# Altium project Davinci Resolve Editor Keyboard.PrjPcb
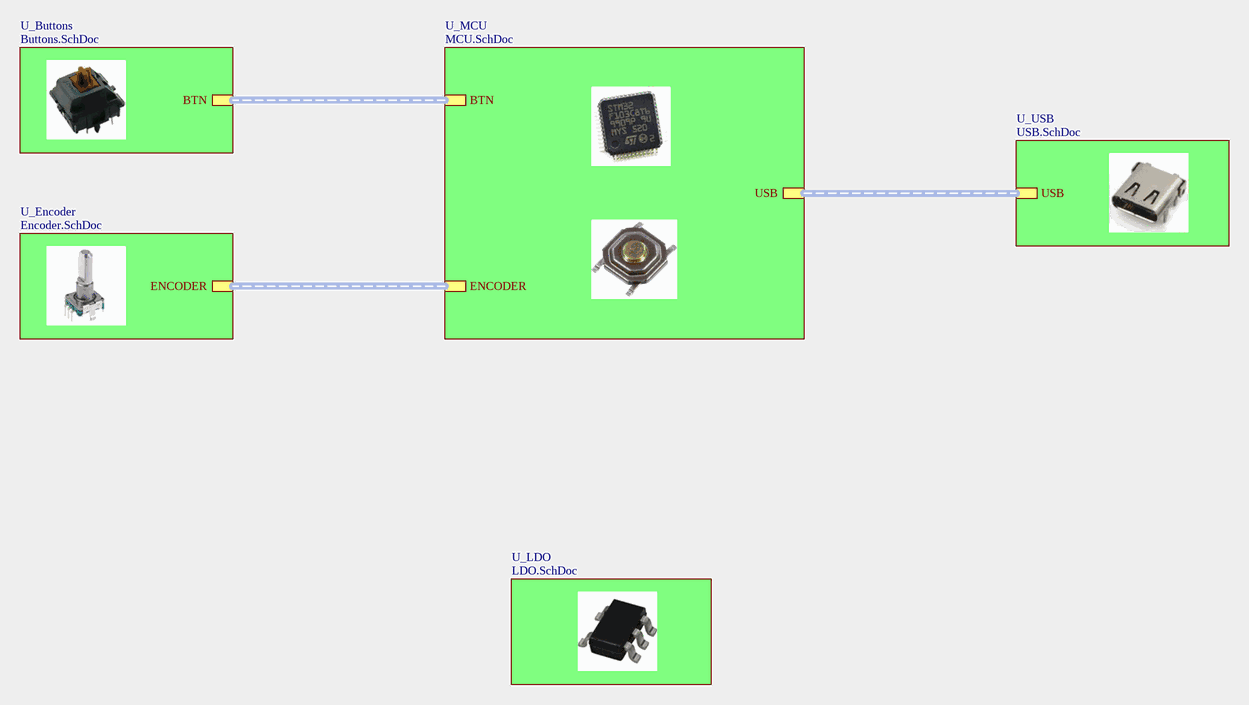
[diagram p0: Davinci Resolve Editor Keyboard.SchDoc]
6 sheets, 196 parts. Net scope: hierarchical (ports join the sheet entries above them; power ports are global).
Board file: Davinci Resolve Editor Keyboard 4.PcbDoc
Sheets:
  Davinci Resolve Editor Keyboard.SchDoc
    U_MCU = MCU.SchDoc
    U_Encoder = Encoder.SchDoc
    U_LDO = LDO.SchDoc
    U_Buttons = Buttons.SchDoc
    U_USB = USB.SchDoc

## Sheet Davinci Resolve Editor Keyboard.SchDoc: STM32F103 Mini Editor Keyboard
size A3; DrawnBy: Roman Sklyar; Organization: S-LAB; Address1: Russian Federation; Address2: Sergiev Posad; DocumentNumber: 1; Revision: v1.0; SheetNumber: 1; SheetTotal: 6

### Sub-sheets
U_Buttons = Buttons.SchDoc: BTN (harness BTN)
U_Encoder = Encoder.SchDoc: ENCODER (harness ENCODER)
U_LDO = LDO.SchDoc: no entries
U_MCU = MCU.SchDoc: BTN (harness BTN), ENCODER (harness ENCODER), USB (harness USB)
U_USB = USB.SchDoc: USB (harness USB)

### Buses and harness runs
harness sheet U_Buttons/BTN = sheet U_MCU/BTN
harness sheet U_Encoder/ENCODER = sheet U_MCU/ENCODER
harness sheet U_MCU/USB = sheet U_USB/USB

### Notes on the sheet
- Title
- Size:
- Date:
- A3
- Number:
- Time:
- Revision:
- Sheet
- of
- File:

## Sheet MCU.SchDoc: Mini Editor Keyboard
size A3; DrawnBy: Roman Sklyar; Organization: S-LAB; Address1: Russian Federation; Address2: Sergiev Posad; DocumentNumber: 2; Revision: v1.0; SheetNumber: 2; SheetTotal: 6
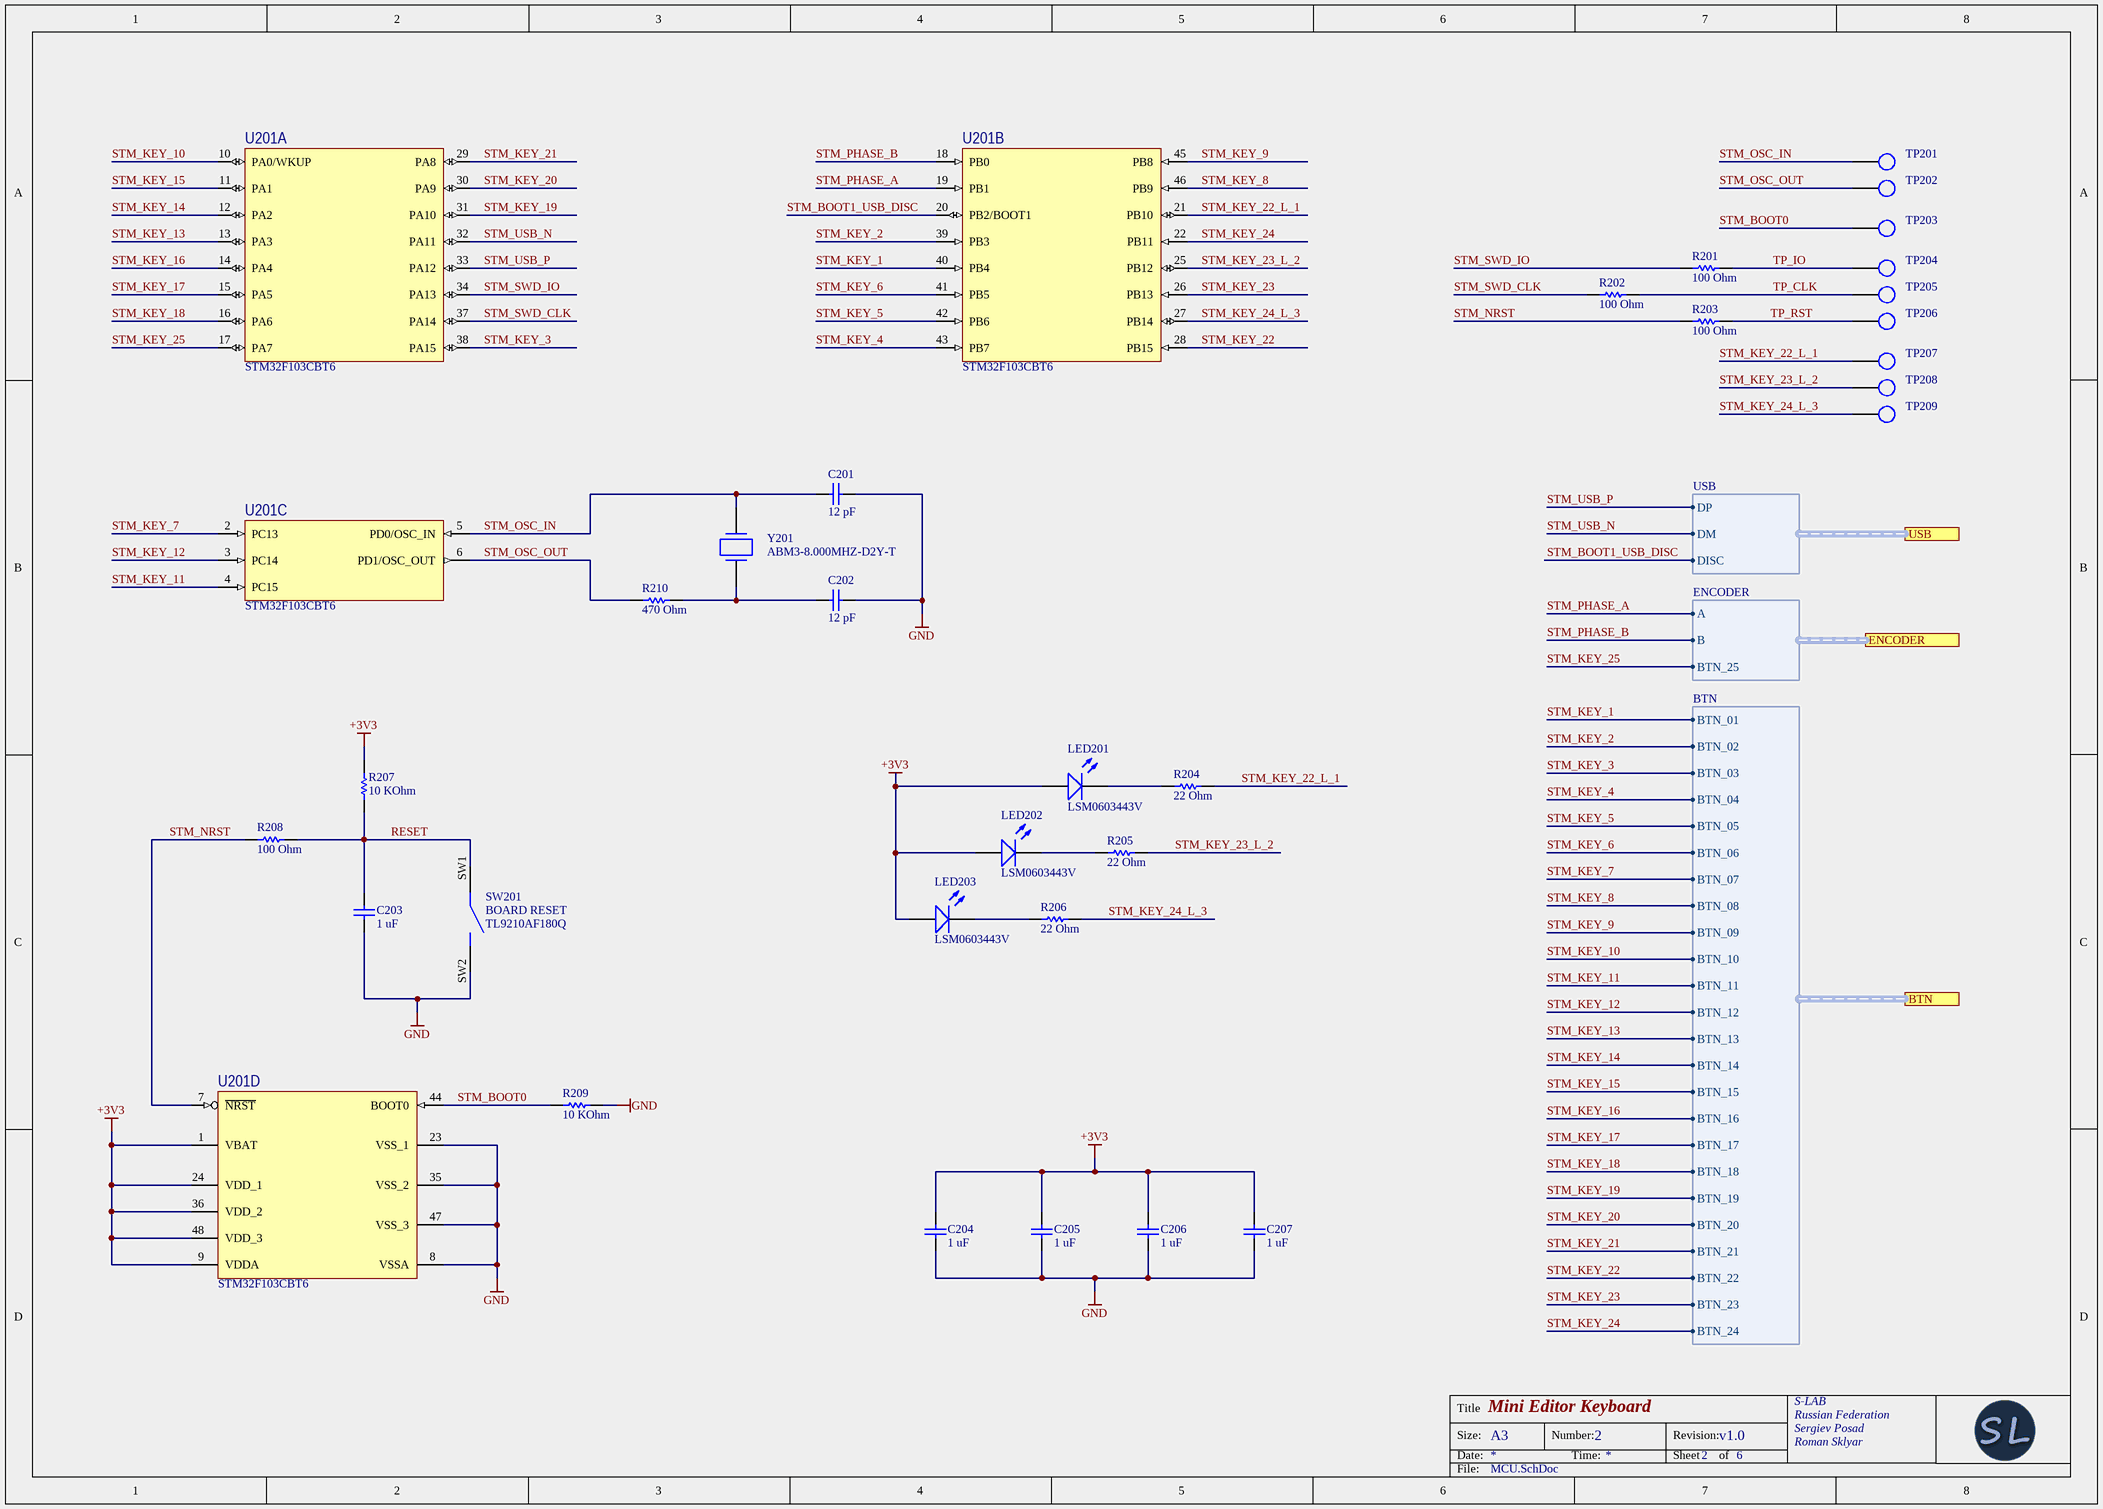
[diagram p1: MCU.SchDoc]

### Parts
C201  Capacitance: 12 pF  [CAPC0603]  (hidden comment: CAP-12P)
C202  Capacitance: 12 pF  [CAPC0603]  (hidden comment: CAP-12P)
C203  Capacitance: 1 uF  [CAPC0805]  (hidden comment: CAP-1U)
C204  Capacitance: 1 uF  [CAPC0805]  (hidden comment: CAP-1U)
C205  Capacitance: 1 uF  [CAPC0805]  (hidden comment: CAP-1U)
C206  Capacitance: 1 uF  [CAPC0805]  (hidden comment: CAP-1U)
C207  Capacitance: 1 uF  [CAPC0805]  (hidden comment: CAP-1U)
LED201  LSM0603443V  [LSM0603-Series]
LED202  LSM0603443V  [LSM0603-Series]
LED203  LSM0603443V  [LSM0603-Series]
R201  Resistance: 100 Ohm  [RES0603]  (hidden comment: RES-100)
R202  Resistance: 100 Ohm  [RES0603]  (hidden comment: RES-100)
R203  Resistance: 100 Ohm  [RES0603]  (hidden comment: RES-100)
R204  Resistance: 22 Ohm  [RES0603]  (hidden comment: RES-22)
R205  Resistance: 22 Ohm  [RES0603]  (hidden comment: RES-22)
R206  Resistance: 22 Ohm  [RES0603]  (hidden comment: RES-22)
R207  Resistance: 10 KOhm  [RES0603]  (hidden comment: RES-10K)
R208  Resistance: 100 Ohm  [RES0603]  (hidden comment: RES-100)
R209  Resistance: 10 KOhm  [RES0603]  (hidden comment: RES-10K)
R210  Resistance: 470 Ohm  [RES0603]  (hidden comment: RES-470)
SW201  BOARD RESET  [TL9210AF180Q]
TP201  (no value)  [TP_C-0.5mm]  (no BOM)
TP202  (no value)  [TP_C-0.5mm]  (no BOM)
TP203  (no value)  [TP_C-0.5mm]  (no BOM)
TP204  (no value)  [TP_C-0.5mm]  (no BOM)
TP205  (no value)  [TP_C-0.5mm]  (no BOM)
TP206  (no value)  [TP_C-0.5mm]  (no BOM)
TP207  (no value)  [TP_C-0.5mm]  (no BOM)
TP208  (no value)  [TP_C-0.5mm]  (no BOM)
TP209  (no value)  [TP_C-0.5mm]  (no BOM)
U201  STM32F103CBT6  [LQFP-48-STM32]  (parts A,B,C,D of 4)
Y201  ABM3-8.000MHZ-D2Y-T  [ABM3-2P]

### Ports
BTN (harness BTN), ENCODER (harness ENCODER), USB (harness USB)

### Harnesses
BTN: BTN_10, BTN_11, BTN_09, BTN_12, BTN_13, BTN_14, BTN_15, BTN_16, BTN_17, BTN_18, BTN_19, BTN_08, BTN_07, BTN_06, BTN_05, BTN_04, BTN_03, BTN_02, BTN_01, BTN_20, BTN_21, BTN_22, BTN_23, BTN_24
USB: DP, DM, DISC
ENCODER: A, B, BTN_25

### Nets
+3V3: C204.2 C205.2 C206.2 C207.2 LED201.2(A) LED202.2(A) LED203.2(A) R207.2 U201.1(VBAT) U201.9(VDDA) U201.24(VDD_1) U201.36(VDD_2) U201.48(VDD_3)
GND: C201.1 C202.1 C203.2 C204.1 C205.1 C206.1 C207.1 R209.2 SW201.SW2 U201.8(VSSA) U201.23(VSS_1) U201.35(VSS_2) U201.47(VSS_3)
RESET: C203.1 R207.1 R208.2 SW201.SW1  [project net RESET_2]
STM_BOOT0: R209.1 TP203.1 U201.44(BOOT0)  [project net STM_BOOT0_2]
STM_BOOT1_USB_DISC: U201.20(PB2/BOOT1) ; port USB.DISC
STM_KEY_1: U201.40(PB4) ; port BTN.BTN_01
STM_KEY_2: U201.39(PB3) ; port BTN.BTN_02
STM_KEY_3: U201.38(PA15) ; port BTN.BTN_03
STM_KEY_4: U201.43(PB7) ; port BTN.BTN_04
STM_KEY_5: U201.42(PB6) ; port BTN.BTN_05
STM_KEY_6: U201.41(PB5) ; port BTN.BTN_06
STM_KEY_7: U201.2(PC13) ; port BTN.BTN_07
STM_KEY_8: U201.46(PB9) ; port BTN.BTN_08
STM_KEY_9: U201.45(PB8) ; port BTN.BTN_09
STM_KEY_10: U201.10(PA0/WKUP) ; port BTN.BTN_10
STM_KEY_11: U201.4(PC15) ; port BTN.BTN_11
STM_KEY_12: U201.3(PC14) ; port BTN.BTN_12
STM_KEY_13: U201.13(PA3) ; port BTN.BTN_13
STM_KEY_14: U201.12(PA2) ; port BTN.BTN_14
STM_KEY_15: U201.11(PA1) ; port BTN.BTN_15
STM_KEY_16: U201.14(PA4) ; port BTN.BTN_16
STM_KEY_17: U201.15(PA5) ; port BTN.BTN_17
STM_KEY_18: U201.16(PA6) ; port BTN.BTN_18
STM_KEY_19: U201.31(PA10) ; port BTN.BTN_19
STM_KEY_20: U201.30(PA9) ; port BTN.BTN_20
STM_KEY_21: U201.29(PA8) ; port BTN.BTN_21
STM_KEY_22: U201.28(PB15) ; port BTN.BTN_22
STM_KEY_22_L_1: R204.2 TP207.1 U201.21(PB10)  [project net STM_KEY_22_L_1_2]
STM_KEY_23: U201.26(PB13) ; port BTN.BTN_23
STM_KEY_23_L_2: R205.2 TP208.1 U201.25(PB12)  [project net STM_KEY_23_L_2_2]
STM_KEY_24: U201.22(PB11) ; port BTN.BTN_24
STM_KEY_24_L_3: R206.2 TP209.1 U201.27(PB14)  [project net STM_KEY_24_L_3_2]
STM_KEY_25: U201.17(PA7) ; port ENCODER.BTN_25
STM_NRST: R203.1 R208.1 U201.7(~{NRST})  [project net STM_NRST_2]
STM_OSC_IN: C201.2 TP201.1 U201.5(PD0/OSC_IN) Y201.2(OSC2)  [project net STM_OSC_IN_2]
STM_OSC_OUT: R210.1 TP202.1 U201.6(PD1/OSC_OUT)  [project net STM_OSC_OUT_2]
STM_PHASE_A: U201.19(PB1) ; port ENCODER.A
STM_PHASE_B: U201.18(PB0) ; port ENCODER.B
STM_SWD_CLK: R202.1 U201.37(PA14)  [project net STM_SWD_CLK_2]
STM_SWD_IO: R201.1 U201.34(PA13)  [project net STM_SWD_IO_2]
STM_USB_N: U201.32(PA11) ; port USB.DM
STM_USB_P: U201.33(PA12) ; port USB.DP
TP_CLK: R202.2 TP205.1  [project net TP_CLK_2]
TP_IO: R201.2 TP204.1  [project net TP_IO_2]
TP_RST: R203.2 TP206.1  [project net TP_RST_2]
NetC202_2: C202.2 R210.2 Y201.1(OSC1)
NetLED201_1: LED201.1(K) R204.1
NetLED202_1: LED202.1(K) R205.1
NetLED203_1: LED203.1(K) R206.1

### Notes on the sheet
- Title
- Size:
- Date:
- A3
- Number:
- Time:
- Revision:
- Sheet
- of
- File:

### Library data of the parts
C201 C202 = CAP-12P: Chip Capacitor, 12 pF, +/- 5%; Voltage Rating: 50 V; Mount: Surface Mount; Tolerance: 5 %; Type: Capacitor
C203-C207 = CAP-1U: Chip Capacitor, 1 uF, +/- 5%; Voltage Rating: 50 V; Mount: Surface Mount; Tolerance: 5 %; Type: Capacitor
LED201-LED203 = LSM0603443V: White LED 0603 3V 20mA; Mount: Surface Mount; Type: LED; Color: White; PartNumber: LSM0603443V
R201-R203 R208 = RES-100: Chip Resistor, 100 Ohm, +/- 1%; Voltage Rating: 50 V; Mount: Surface Mount; Tolerance: 1 %; Type: Resistor
R204-R206 = RES-22: Chip Resistor, 22 Ohm, +/- 1%; Voltage Rating: 50 V; Mount: Surface Mount; Tolerance: 1 %; Type: Resistor
R207 R209 = RES-10K: Chip Resistor, 10 KOhm, +/- 1%; Voltage Rating: 50 V; Mount: Surface Mount; Tolerance: 1 %; Type: Resistor
R210 = RES-470: Chip Resistor, 470 Ohm, +/- 1%; Voltage Rating: 50 V; Mount: Surface Mount; Tolerance: 1 %; Type: Resistor
SW201 = TL9210AF180Q: SMD Tactile Switch, SPST, 180 gf, 12 VDC, 50 mA; Type: Tactile Switch Soft; Mount: Surface Mount; Model: TL9210AF180Q
TP201-TP209 = TestPad
U201 = STM32F103C8T6: ARM based 32-bit MCU with 64 or 128 KB Flash; Digit: 32 bit; Type: Microcontroller; Mount: Surface Mount; PartNumber: STM32F103CBT6
Y201 = ABM3-8.000MHZ-D2Y-T: 8MHz ±20ppm 18pF 140 Ohm SMD Crystal Resonators; Type: Quartz Crystal Resonator; Mount: Surface Mount; Frequency: 8 MHz; PartNumber: ABM3-8.000MHZ-D2Y-T

## Sheet Encoder.SchDoc: Mini Editor Keyboard
size A3; DrawnBy: Roman Sklyar; Organization: S-LAB; Address1: Russian Federation; Address2: Sergiev Posad; DocumentNumber: 5; Revision: v1.0; SheetNumber: 5; SheetTotal: 6
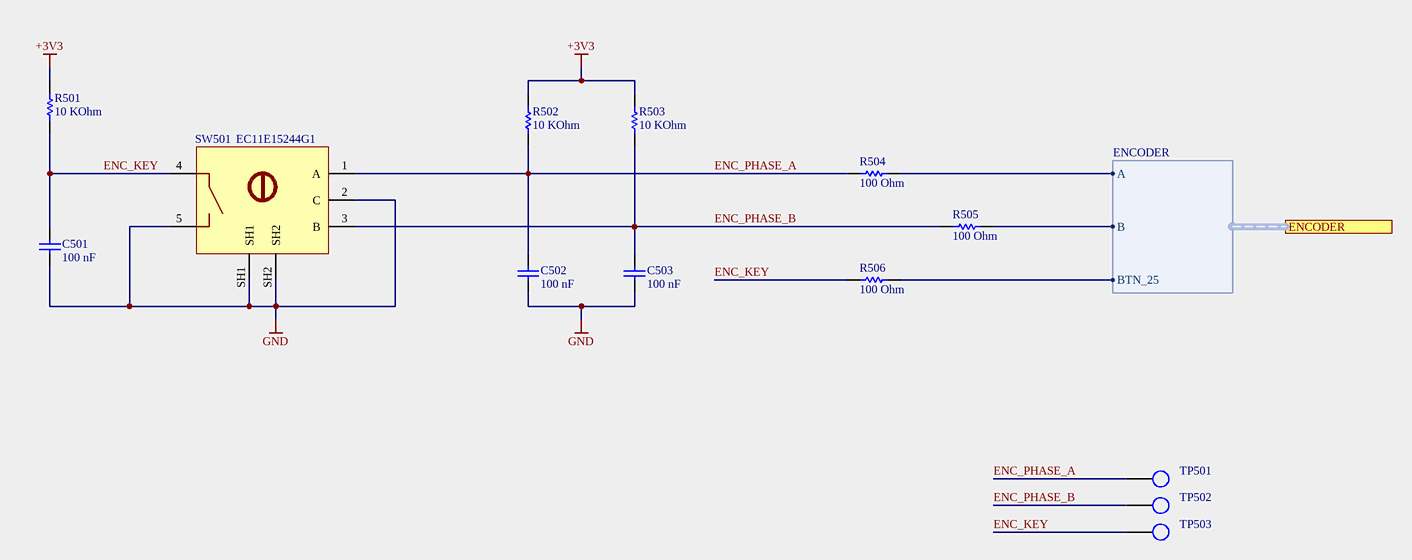
[diagram p2: Encoder.SchDoc]

### Parts
C501  Capacitance: 100 nF  [CAPC0603]  (hidden comment: CAP-100N)
C502  Capacitance: 100 nF  [CAPC0603]  (hidden comment: CAP-100N)
C503  Capacitance: 100 nF  [CAPC0603]  (hidden comment: CAP-100N)
R501  Resistance: 10 KOhm  [RES0603]  (hidden comment: RES-10K)
R502  Resistance: 10 KOhm  [RES0603]  (hidden comment: RES-10K)
R503  Resistance: 10 KOhm  [RES0603]  (hidden comment: RES-10K)
R504  Resistance: 100 Ohm  [RES0603]  (hidden comment: RES-100)
R505  Resistance: 100 Ohm  [RES0603]  (hidden comment: RES-100)
R506  Resistance: 100 Ohm  [RES0603]  (hidden comment: RES-100)
SW501  EC11E15244G1  [EC11E15244G1]
TP501  (no value)  [TP_C-0.5mm]  (no BOM)
TP502  (no value)  [TP_C-0.5mm]  (no BOM)
TP503  (no value)  [TP_C-0.5mm]  (no BOM)

### Ports
ENCODER (harness ENCODER)

### Harnesses
ENCODER: A, B, BTN_25

### Nets
+3V3: R501.2 R502.2 R503.2
GND: C501.1 C502.1 C503.1 SW501.2(C) SW501.5 SW501.SH1 SW501.SH2
ENC_KEY: C501.2 R501.1 R506.1 SW501.4 TP503.1  [project net ENC_KEY_5]
ENC_PHASE_A: C502.2 R502.1 R504.1 SW501.1(A) TP501.1  [project net ENC_PHASE_A_5]
ENC_PHASE_B: C503.2 R503.1 R505.1 SW501.3(B) TP502.1  [project net ENC_PHASE_B_5]
STM_KEY_25: R506.2 ; port ENCODER.BTN_25
STM_PHASE_A: R504.2 ; port ENCODER.A
STM_PHASE_B: R505.2 ; port ENCODER.B

### Notes on the sheet
- Title
- Size:
- Date:
- A3
- Number:
- Time:
- Revision:
- Sheet
- of
- File:

### Library data of the parts
C501-C503 = CAP-100N: Chip Capacitor, 100 nF, +/- 5%; Voltage Rating: 50 V; Mount: Surface Mount; Tolerance: 5 %; Type: Capacitor
R501-R503 = RES-10K: as R207 on sheet MCU; Mount: Surface Mount; Tolerance: 1 %; Type: Resistor
R504-R506 = RES-100: as R201 on sheet MCU; Mount: Surface Mount; Tolerance: 1 %; Type: Resistor
SW501 = EC11E15244G1: 11mm Size Metal Shaft Type Encoder; Manufacture: Alpsalpine; LengthShaft: 20 mm; NumberPulse: 15; Type: Encoder; Mount: True Hole; PartNumber: EC11E15244G1
TP501-TP503 = TestPad

## Sheet LDO.SchDoc: Mini Editor Keyboard
size A3; DrawnBy: Roman Sklyar; Organization: S-LAB; Address1: Russian Federation; Address2: Sergiev Posad; DocumentNumber: 3; Revision: v1.0; SheetNumber: 3; SheetTotal: 6
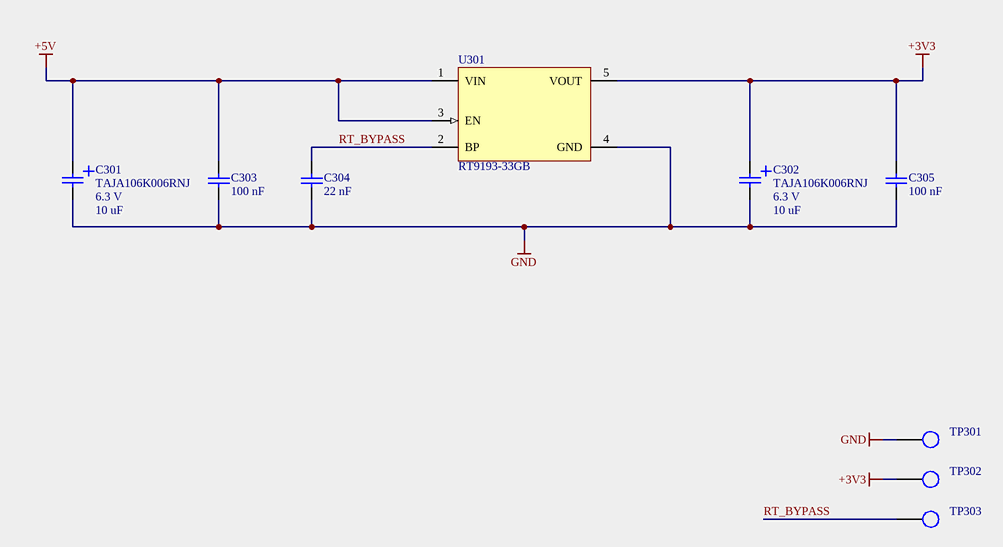
[diagram p3: LDO.SchDoc]

### Parts
C301  PartNumber: TAJA106K006RNJ  Voltage Rating: 6.3 V  Capacitance: 10 uF  [CAPMP-A-1206-3216X18]  (hidden comment: CAP-10U-6V3_A)
C302  PartNumber: TAJA106K006RNJ  Voltage Rating: 6.3 V  Capacitance: 10 uF  [CAPMP-A-1206-3216X18]  (hidden comment: CAP-10U-6V3_A)
C303  Capacitance: 100 nF  [CAPC0603]  (hidden comment: CAP-100N)
C304  Capacitance: 22 nF  [CAPC0603]  (hidden comment: CAP-22N)
C305  Capacitance: 100 nF  [CAPC0603]  (hidden comment: CAP-100N)
TP301  (no value)  [TP_C-0.5mm]  (no BOM)
TP302  (no value)  [TP_C-0.5mm]  (no BOM)
TP303  (no value)  [TP_C-0.5mm]  (no BOM)
U301  RT9193-33GB  [SOT-23-5-RICHTEK]

### Nets
+3V3: C302.1 C305.2 TP302.1 U301.5(VOUT)
+5V: C301.1 C303.2 U301.1(VIN) U301.3(EN)
GND: C301.2 C302.2 C303.1 C304.1 C305.1 TP301.1 U301.4(GND)
RT_BYPASS: C304.2 TP303.1 U301.2(BP)  [project net RT_BYPASS_3]

### Notes on the sheet
- Title
- Size:
- Date:
- A3
- Number:
- Time:
- Revision:
- Sheet
- of
- File:

### Library data of the parts
C301 C302 = CAP-10U-6V3_A: 10uF ±10% 6.3V -55℃ ~ +125℃ Tantalum Capacitors; Mount: Surface Mount; Type: Tantalum Capacitor
C303 C305 = CAP-100N: as C501 on sheet Encoder; Mount: Surface Mount; Tolerance: 5 %; Type: Capacitor
C304 = CAP-22N: Chip Capacitor, 22 nF, +/- 5%; Voltage Rating: 50 V; Mount: Surface Mount; Tolerance: 5 %; Type: Capacitor
TP301-TP303 = TestPad
U301 = RT9193-33GB: Fixed 5.5V 3.3V 220mV @ 300mA SOT-23-5 Dropout Regulators(LDO); Type: LDO; Mount: Surface Mount; Package: SOT-23-5; PartNumber: RT9193-33GB

## Sheet Buttons.SchDoc: Mini Editor Keyboard
size A2; DrawnBy: Roman Sklyar; Organization: S-LAB; Address1: Russian Federation; Address2: Sergiev Posad; DocumentNumber: 6; Revision: v1.0; SheetNumber: 6; SheetTotal: 6
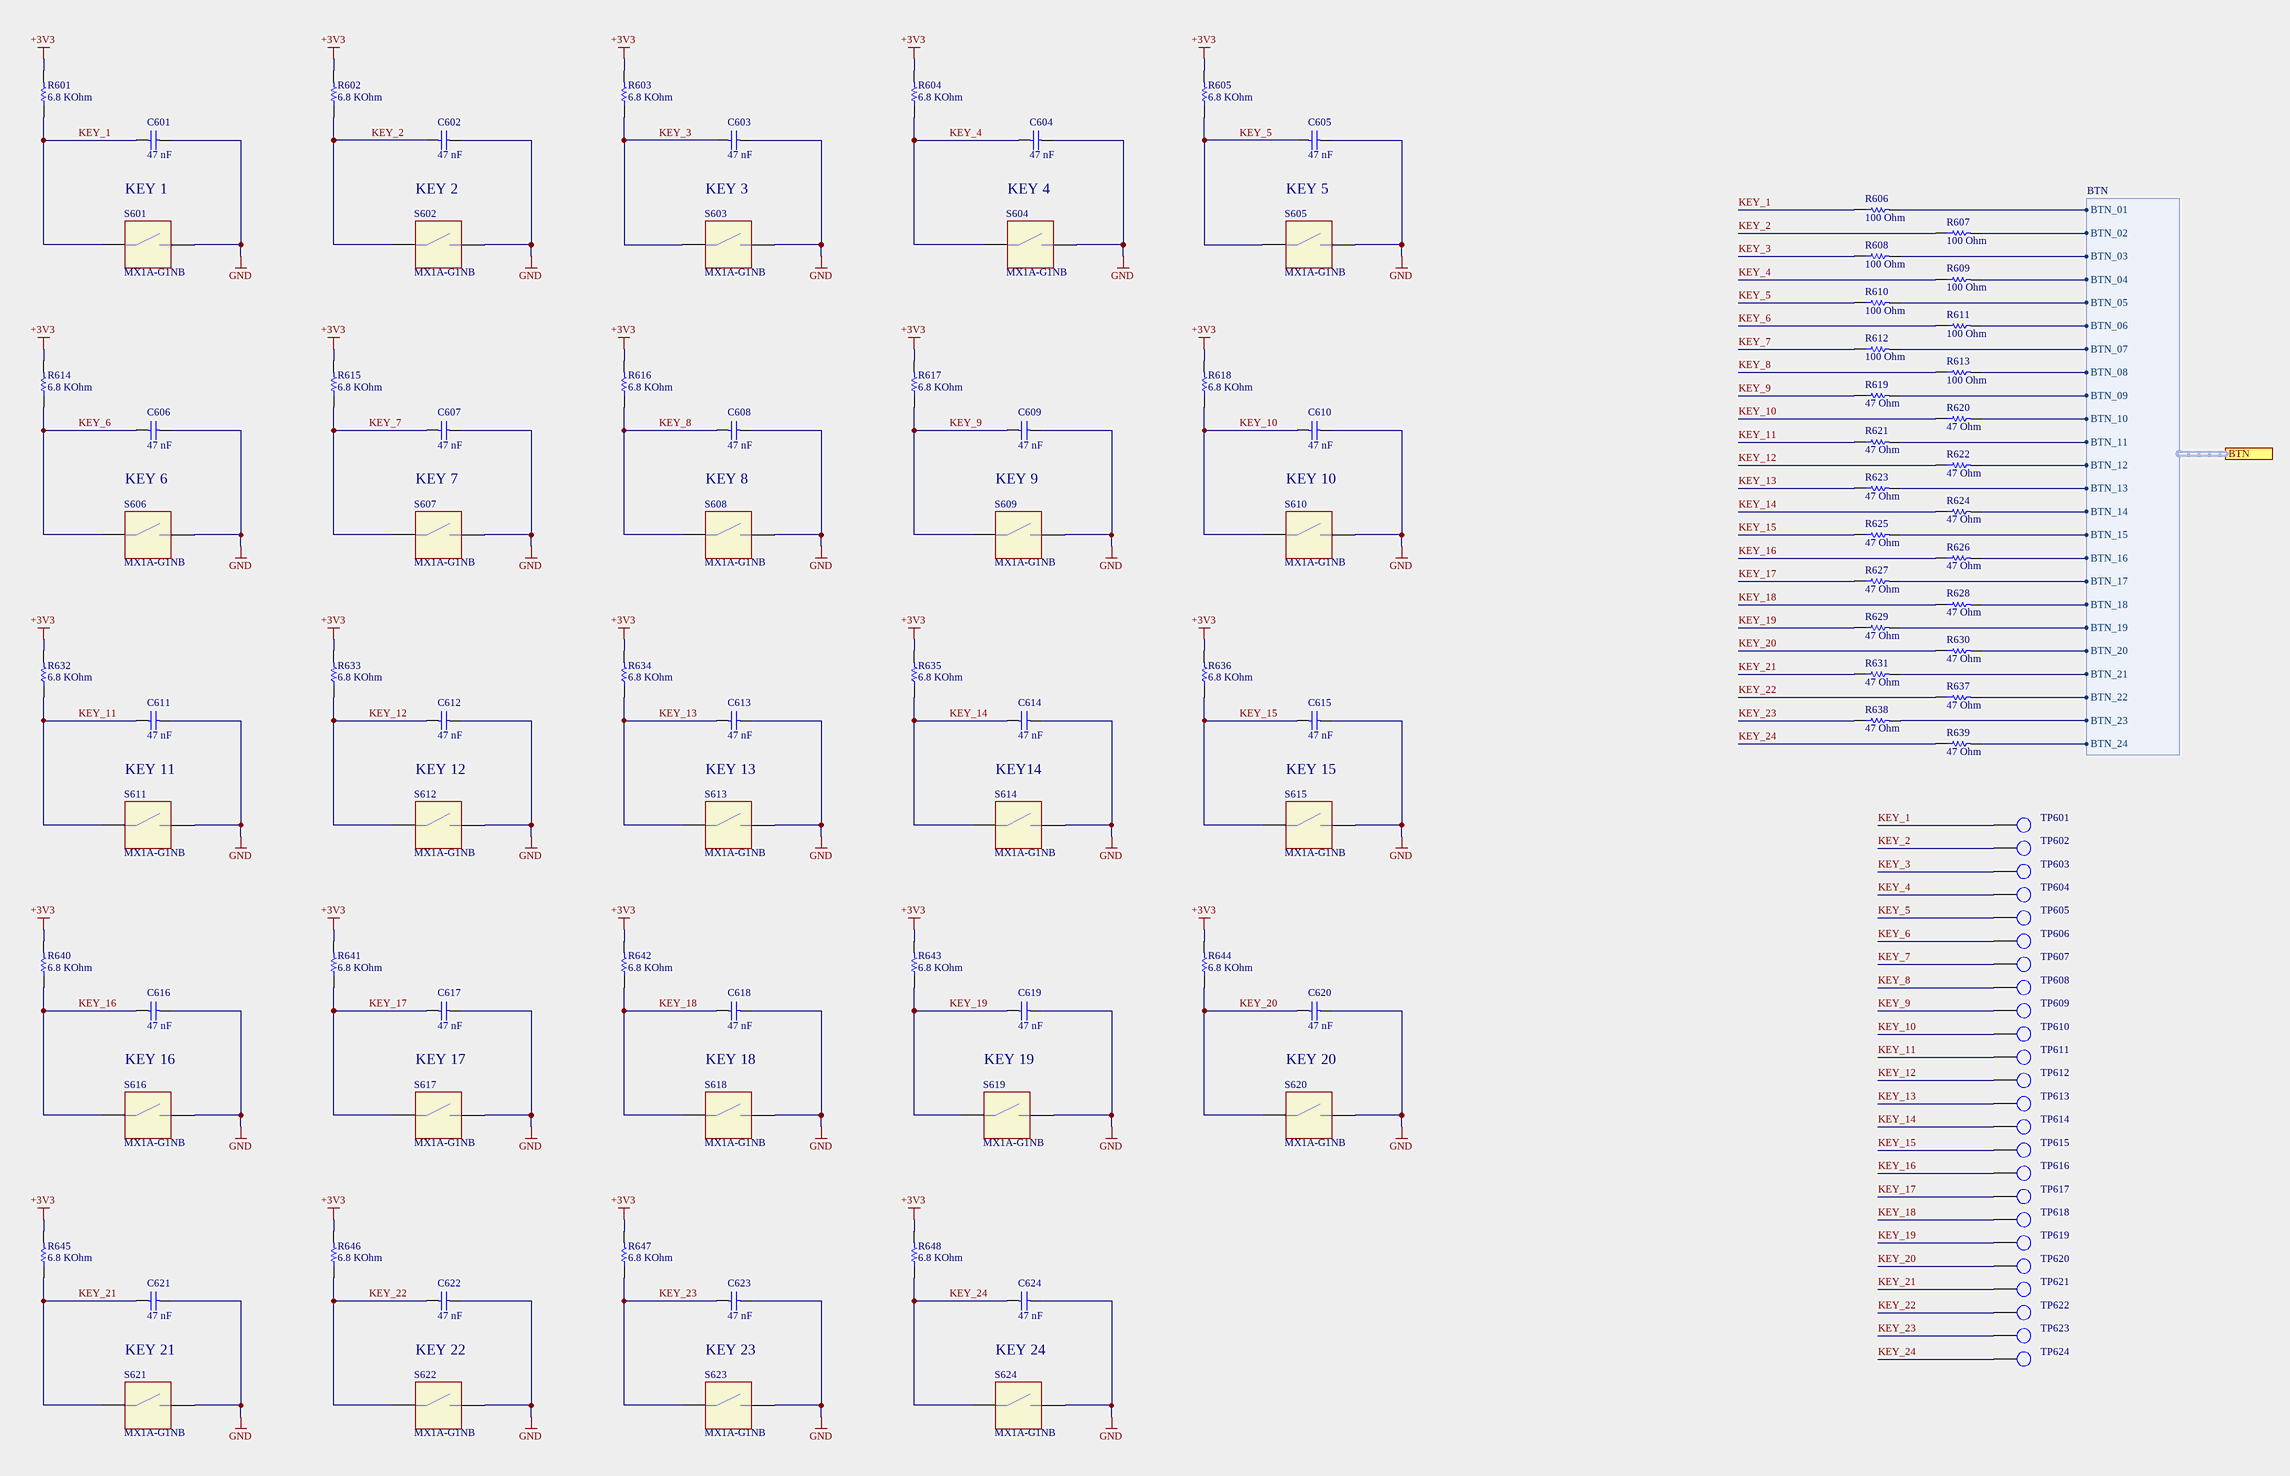
[diagram p4: Buttons.SchDoc]

### Parts
C601  Capacitance: 47 nF  [CAPC0603]  (hidden comment: CAP-47N)
C602  Capacitance: 47 nF  [CAPC0603]  (hidden comment: CAP-47N)
C603  Capacitance: 47 nF  [CAPC0603]  (hidden comment: CAP-47N)
C604  Capacitance: 47 nF  [CAPC0603]  (hidden comment: CAP-47N)
C605  Capacitance: 47 nF  [CAPC0603]  (hidden comment: CAP-47N)
C606  Capacitance: 47 nF  [CAPC0603]  (hidden comment: CAP-47N)
C607  Capacitance: 47 nF  [CAPC0603]  (hidden comment: CAP-47N)
C608  Capacitance: 47 nF  [CAPC0603]  (hidden comment: CAP-47N)
C609  Capacitance: 47 nF  [CAPC0603]  (hidden comment: CAP-47N)
C610  Capacitance: 47 nF  [CAPC0603]  (hidden comment: CAP-47N)
C611  Capacitance: 47 nF  [CAPC0603]  (hidden comment: CAP-47N)
C612  Capacitance: 47 nF  [CAPC0603]  (hidden comment: CAP-47N)
C613  Capacitance: 47 nF  [CAPC0603]  (hidden comment: CAP-47N)
C614  Capacitance: 47 nF  [CAPC0603]  (hidden comment: CAP-47N)
C615  Capacitance: 47 nF  [CAPC0603]  (hidden comment: CAP-47N)
C616  Capacitance: 47 nF  [CAPC0603]  (hidden comment: CAP-47N)
C617  Capacitance: 47 nF  [CAPC0603]  (hidden comment: CAP-47N)
C618  Capacitance: 47 nF  [CAPC0603]  (hidden comment: CAP-47N)
C619  Capacitance: 47 nF  [CAPC0603]  (hidden comment: CAP-47N)
C620  Capacitance: 47 nF  [CAPC0603]  (hidden comment: CAP-47N)
C621  Capacitance: 47 nF  [CAPC0603]  (hidden comment: CAP-47N)
C622  Capacitance: 47 nF  [CAPC0603]  (hidden comment: CAP-47N)
C623  Capacitance: 47 nF  [CAPC0603]  (hidden comment: CAP-47N)
C624  Capacitance: 47 nF  [CAPC0603]  (hidden comment: CAP-47N)
R601  Resistance: 6.8 KOhm  [RES0603]  (hidden comment: RES-6K8)
R602  Resistance: 6.8 KOhm  [RES0603]  (hidden comment: RES-6K8)
R603  Resistance: 6.8 KOhm  [RES0603]  (hidden comment: RES-6K8)
R604  Resistance: 6.8 KOhm  [RES0603]  (hidden comment: RES-6K8)
R605  Resistance: 6.8 KOhm  [RES0603]  (hidden comment: RES-6K8)
R606  Resistance: 100 Ohm  [RES0603]  (hidden comment: RES-100)
R607  Resistance: 100 Ohm  [RES0603]  (hidden comment: RES-100)
R608  Resistance: 100 Ohm  [RES0603]  (hidden comment: RES-100)
R609  Resistance: 100 Ohm  [RES0603]  (hidden comment: RES-100)
R610  Resistance: 100 Ohm  [RES0603]  (hidden comment: RES-100)
R611  Resistance: 100 Ohm  [RES0603]  (hidden comment: RES-100)
R612  Resistance: 100 Ohm  [RES0603]  (hidden comment: RES-100)
R613  Resistance: 100 Ohm  [RES0603]  (hidden comment: RES-100)
R614  Resistance: 6.8 KOhm  [RES0603]  (hidden comment: RES-6K8)
R615  Resistance: 6.8 KOhm  [RES0603]  (hidden comment: RES-6K8)
R616  Resistance: 6.8 KOhm  [RES0603]  (hidden comment: RES-6K8)
R617  Resistance: 6.8 KOhm  [RES0603]  (hidden comment: RES-6K8)
R618  Resistance: 6.8 KOhm  [RES0603]  (hidden comment: RES-6K8)
R619  Resistance: 47 Ohm  [RES0603]  (hidden comment: RES-47)
R620  Resistance: 47 Ohm  [RES0603]  (hidden comment: RES-47)
R621  Resistance: 47 Ohm  [RES0603]  (hidden comment: RES-47)
R622  Resistance: 47 Ohm  [RES0603]  (hidden comment: RES-47)
R623  Resistance: 47 Ohm  [RES0603]  (hidden comment: RES-47)
R624  Resistance: 47 Ohm  [RES0603]  (hidden comment: RES-47)
R625  Resistance: 47 Ohm  [RES0603]  (hidden comment: RES-47)
R626  Resistance: 47 Ohm  [RES0603]  (hidden comment: RES-47)
R627  Resistance: 47 Ohm  [RES0603]  (hidden comment: RES-47)
R628  Resistance: 47 Ohm  [RES0603]  (hidden comment: RES-47)
R629  Resistance: 47 Ohm  [RES0603]  (hidden comment: RES-47)
R630  Resistance: 47 Ohm  [RES0603]  (hidden comment: RES-47)
R631  Resistance: 47 Ohm  [RES0603]  (hidden comment: RES-47)
R632  Resistance: 6.8 KOhm  [RES0603]  (hidden comment: RES-6K8)
R633  Resistance: 6.8 KOhm  [RES0603]  (hidden comment: RES-6K8)
R634  Resistance: 6.8 KOhm  [RES0603]  (hidden comment: RES-6K8)
R635  Resistance: 6.8 KOhm  [RES0603]  (hidden comment: RES-6K8)
R636  Resistance: 6.8 KOhm  [RES0603]  (hidden comment: RES-6K8)
R637  Resistance: 47 Ohm  [RES0603]  (hidden comment: RES-47)
R638  Resistance: 47 Ohm  [RES0603]  (hidden comment: RES-47)
R639  Resistance: 47 Ohm  [RES0603]  (hidden comment: RES-47)
R640  Resistance: 6.8 KOhm  [RES0603]  (hidden comment: RES-6K8)
R641  Resistance: 6.8 KOhm  [RES0603]  (hidden comment: RES-6K8)
R642  Resistance: 6.8 KOhm  [RES0603]  (hidden comment: RES-6K8)
R643  Resistance: 6.8 KOhm  [RES0603]  (hidden comment: RES-6K8)
R644  Resistance: 6.8 KOhm  [RES0603]  (hidden comment: RES-6K8)
R645  Resistance: 6.8 KOhm  [RES0603]  (hidden comment: RES-6K8)
R646  Resistance: 6.8 KOhm  [RES0603]  (hidden comment: RES-6K8)
R647  Resistance: 6.8 KOhm  [RES0603]  (hidden comment: RES-6K8)
R648  Resistance: 6.8 KOhm  [RES0603]  (hidden comment: RES-6K8)
S601  KEY 1  [CHERRY MX PCB WITHOUT LED]
S602  KEY 2  [CHERRY MX PCB WITHOUT LED]
S603  KEY 3  [CHERRY MX PCB WITHOUT LED]
S604  KEY 4  [CHERRY MX PCB WITHOUT LED]
S605  KEY 5  [CHERRY MX PCB WITHOUT LED]
S606  KEY 6  [CHERRY MX PCB WITHOUT LED]
S607  KEY 7  [CHERRY MX PCB WITHOUT LED]
S608  KEY 8  [CHERRY MX PCB WITHOUT LED]
S609  KEY 9  [CHERRY MX PCB WITHOUT LED]
S610  KEY 10  [CHERRY MX PCB WITHOUT LED]
S611  KEY 11  [CHERRY MX PCB WITHOUT LED]
S612  KEY 12  [CHERRY MX PCB WITHOUT LED]
S613  KEY 13  [CHERRY MX PCB WITHOUT LED]
S614  KEY14  [CHERRY MX PCB WITHOUT LED]
S615  KEY 15  [CHERRY MX PCB WITHOUT LED]
S616  KEY 16  [CHERRY MX PCB WITHOUT LED]
S617  KEY 17  [CHERRY MX PCB WITHOUT LED]
S618  KEY 18  [CHERRY MX PCB WITHOUT LED]
S619  KEY 19  [CHERRY MX PCB WITHOUT LED]
S620  KEY 20  [CHERRY MX PCB WITHOUT LED]
S621  KEY 21  [CHERRY MX PCB WITHOUT LED]
S622  KEY 22  [CHERRY MX PCB WITHOUT LED]
S623  KEY 23  [CHERRY MX PCB WITHOUT LED]
S624  KEY 24  [CHERRY MX PCB WITHOUT LED]
TP601  (no value)  [TP_C-0.5mm]  (no BOM)
TP602  (no value)  [TP_C-0.5mm]  (no BOM)
TP603  (no value)  [TP_C-0.5mm]  (no BOM)
TP604  (no value)  [TP_C-0.5mm]  (no BOM)
TP605  (no value)  [TP_C-0.5mm]  (no BOM)
TP606  (no value)  [TP_C-0.5mm]  (no BOM)
TP607  (no value)  [TP_C-0.5mm]  (no BOM)
TP608  (no value)  [TP_C-0.5mm]  (no BOM)
TP609  (no value)  [TP_C-0.5mm]  (no BOM)
TP610  (no value)  [TP_C-0.5mm]  (no BOM)
TP611  (no value)  [TP_C-0.5mm]  (no BOM)
TP612  (no value)  [TP_C-0.5mm]  (no BOM)
TP613  (no value)  [TP_C-0.5mm]  (no BOM)
TP614  (no value)  [TP_C-0.5mm]  (no BOM)
TP615  (no value)  [TP_C-0.5mm]  (no BOM)
TP616  (no value)  [TP_C-0.5mm]  (no BOM)
TP617  (no value)  [TP_C-0.5mm]  (no BOM)
TP618  (no value)  [TP_C-0.5mm]  (no BOM)
TP619  (no value)  [TP_C-0.5mm]  (no BOM)
TP620  (no value)  [TP_C-0.5mm]  (no BOM)
TP621  (no value)  [TP_C-0.5mm]  (no BOM)
TP622  (no value)  [TP_C-0.5mm]  (no BOM)
TP623  (no value)  [TP_C-0.5mm]  (no BOM)
TP624  (no value)  [TP_C-0.5mm]  (no BOM)

### Ports
BTN (harness BTN)

### Harnesses
BTN: BTN_10, BTN_11, BTN_09, BTN_12, BTN_13, BTN_14, BTN_15, BTN_16, BTN_17, BTN_18, BTN_19, BTN_08, BTN_07, BTN_06, BTN_05, BTN_04, BTN_03, BTN_02, BTN_01, BTN_20, BTN_21, BTN_22, BTN_23, BTN_24

### Nets
+3V3: R601.2 R602.2 R603.2 R604.2 R605.2 R614.2 R615.2 R616.2 R617.2 R618.2 R632.2 R633.2 R634.2 R635.2 R636.2 R640.2 R641.2 R642.2 R643.2 R644.2 R645.2 R646.2 R647.2 R648.2
GND: C601.2 C602.2 C603.2 C604.2 C605.2 C606.2 C607.2 C608.2 C609.2 C610.2 C611.2 C612.2 C613.2 C614.2 C615.2 C616.2 C617.2 C618.2 C619.2 C620.2 C621.2 C622.2 C623.2 C624.2 S601.S2 S602.S2 S603.S2 S604.S2 S605.S2 S606.S2 S607.S2 S608.S2 S609.S2 S610.S2 S611.S2 S612.S2 S613.S2 S614.S2 S615.S2 S616.S2 S617.S2 S618.S2 S619.S2 S620.S2 S621.S2 S622.S2 S623.S2 S624.S2
KEY_1: C601.1 R601.1 R606.1 S601.S1 TP601.1  [project net KEY_1_6]
KEY_2: C602.1 R602.1 R607.1 S602.S1 TP602.1  [project net KEY_2_6]
KEY_3: C603.1 R603.1 R608.1 S603.S1 TP603.1  [project net KEY_3_6]
KEY_4: C604.1 R604.1 R609.1 S604.S1 TP604.1  [project net KEY_4_6]
KEY_5: C605.1 R605.1 R610.1 S605.S1 TP605.1  [project net KEY_5_6]
KEY_6: C606.1 R611.1 R614.1 S606.S1 TP606.1  [project net KEY_6_6]
KEY_7: C607.1 R612.1 R615.1 S607.S1 TP607.1  [project net KEY_7_6]
KEY_8: C608.1 R613.1 R616.1 S608.S1 TP608.1  [project net KEY_8_6]
KEY_9: C609.1 R617.1 R619.1 S609.S1 TP609.1  [project net KEY_9_6]
KEY_10: C610.1 R618.1 R620.1 S610.S1 TP610.1  [project net KEY_10_6]
KEY_11: C611.1 R621.1 R632.1 S611.S1 TP611.1  [project net KEY_11_6]
KEY_12: C612.1 R622.1 R633.1 S612.S1 TP612.1  [project net KEY_12_6]
KEY_13: C613.1 R623.1 R634.1 S613.S1 TP613.1  [project net KEY_13_6]
KEY_14: C614.1 R624.1 R635.1 S614.S1 TP614.1  [project net KEY_14_6]
KEY_15: C615.1 R625.1 R636.1 S615.S1 TP615.1  [project net KEY_15_6]
KEY_16: C616.1 R626.1 R640.1 S616.S1 TP616.1  [project net KEY_16_6]
KEY_17: C617.1 R627.1 R641.1 S617.S1 TP617.1  [project net KEY_17_6]
KEY_18: C618.1 R628.1 R642.1 S618.S1 TP618.1  [project net KEY_18_6]
KEY_19: C619.1 R629.1 R643.1 S619.S1 TP619.1  [project net KEY_19_6]
KEY_20: C620.1 R630.1 R644.1 S620.S1 TP620.1  [project net KEY_20_6]
KEY_21: C621.1 R631.1 R645.1 S621.S1 TP621.1  [project net KEY_21_6]
KEY_22: C622.1 R637.1 R646.1 S622.S1 TP622.1  [project net KEY_22_6]
KEY_23: C623.1 R638.1 R647.1 S623.S1 TP623.1  [project net KEY_23_6]
KEY_24: C624.1 R639.1 R648.1 S624.S1 TP624.1  [project net KEY_24_6]
STM_KEY_1: R606.2 ; port BTN.BTN_01
STM_KEY_2: R607.2 ; port BTN.BTN_02
STM_KEY_3: R608.2 ; port BTN.BTN_03
STM_KEY_4: R609.2 ; port BTN.BTN_04
STM_KEY_5: R610.2 ; port BTN.BTN_05
STM_KEY_6: R611.2 ; port BTN.BTN_06
STM_KEY_7: R612.2 ; port BTN.BTN_07
STM_KEY_8: R613.2 ; port BTN.BTN_08
STM_KEY_9: R619.2 ; port BTN.BTN_09
STM_KEY_10: R620.2 ; port BTN.BTN_10
STM_KEY_11: R621.2 ; port BTN.BTN_11
STM_KEY_12: R622.2 ; port BTN.BTN_12
STM_KEY_13: R623.2 ; port BTN.BTN_13
STM_KEY_14: R624.2 ; port BTN.BTN_14
STM_KEY_15: R625.2 ; port BTN.BTN_15
STM_KEY_16: R626.2 ; port BTN.BTN_16
STM_KEY_17: R627.2 ; port BTN.BTN_17
STM_KEY_18: R628.2 ; port BTN.BTN_18
STM_KEY_19: R629.2 ; port BTN.BTN_19
STM_KEY_20: R630.2 ; port BTN.BTN_20
STM_KEY_21: R631.2 ; port BTN.BTN_21
STM_KEY_22: R637.2 ; port BTN.BTN_22
STM_KEY_23: R638.2 ; port BTN.BTN_23
STM_KEY_24: R639.2 ; port BTN.BTN_24

### Notes on the sheet
- Title
- Size:
- Date:
- File:
- A2
- Number:
- Time:
- Revision:
- Sheet
- of

### Library data of the parts
C601-C624 = CAP-47N: Chip Capacitor, 47 nF, +/- 5%; Voltage Rating: 50 V; Mount: Surface Mount; Tolerance: 5 %; Type: Capacitor
R601-R605 R614-R618 R632-R636 R640-R648 = RES-6K8: Chip Resistor, 6.8 KOhm, +/- 1%; Voltage Rating: 50 V; Mount: Surface Mount; Tolerance: 1 %; Type: Resistor
R606-R613 = RES-100: as R201 on sheet MCU; Mount: Surface Mount; Tolerance: 1 %; Type: Resistor
R619-R631 R637-R639 = RES-47: Chip Resistor, 47 Ohm, +/- 1%; Voltage Rating: 50 V; Mount: Surface Mount; Tolerance: 1 %; Type: Resistor
S601-S624 = MX1A-G1NB: CHERRY MX Brown RGB Keyswitch 55cN; Type: Switch; Mount: Through Hole; Model: MX1A-G1NB
TP601-TP624 = TestPad

## Sheet USB.SchDoc: Mini Editor Keyboard
size A3; DrawnBy: Roman Sklyar; Organization: S-LAB; Address1: Russian Federation; Address2: Sergiev Posad; DocumentNumber: 4; Revision: v1.0; SheetNumber: 4; SheetTotal: 6
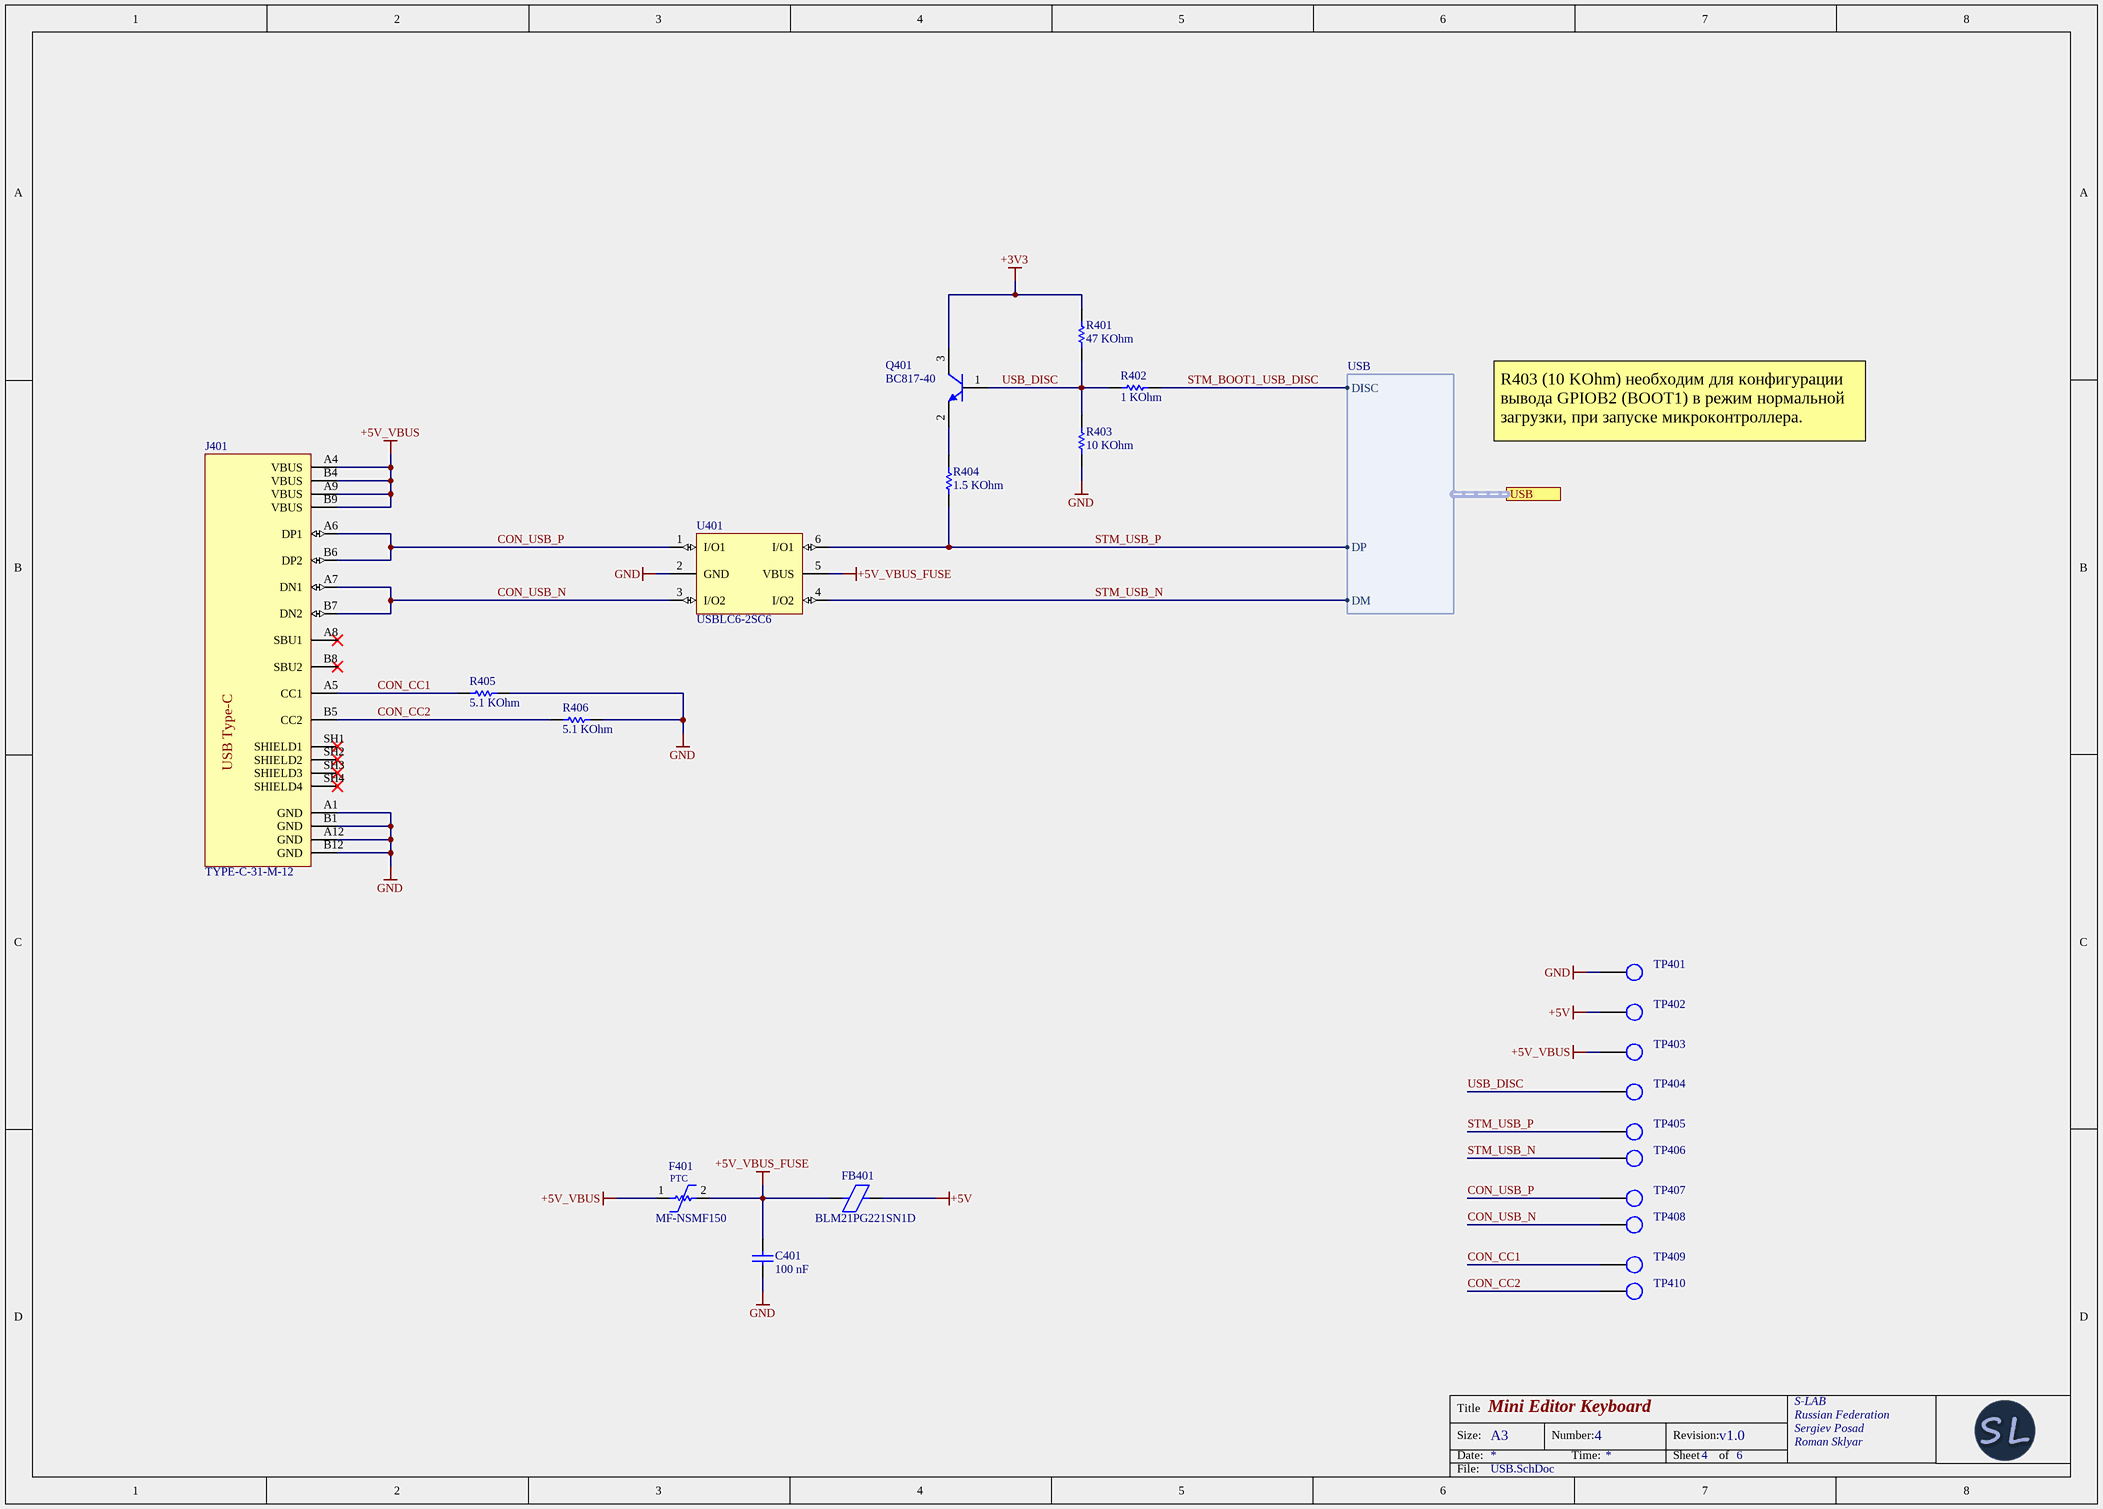
[diagram p5: USB.SchDoc]

### Parts
C401  Capacitance: 100 nF  [CAPC0603]  (hidden comment: CAP-100N)
F401  MF-NSMF150  [PTC1206-BOURNS]
FB401  BLM21PG221SN1D  [INDC-0805-2012X10]
J401  TYPE-C-31-M-12  [TYPE-C-31-M-12]
Q401  BC817-40  [SOT23-3-AnBon]
R401  Resistance: 47 KOhm  [RES0603]  (hidden comment: RES-47K)
R402  Resistance: 1 KOhm  [RES0603]  (hidden comment: RES-1K)
R403  Resistance: 10 KOhm  [RES0603]  (hidden comment: RES-10K)
R404  Resistance: 1.5 KOhm  [RES0603]  (hidden comment: RES-1K5)
R405  Resistance: 5.1 KOhm  [RES0603]  (hidden comment: RES-5K1)
R406  Resistance: 5.1 KOhm  [RES0603]  (hidden comment: RES-5K1)
TP401  (no value)  [TP_C-0.5mm]  (no BOM)
TP402  (no value)  [TP_C-0.5mm]  (no BOM)
TP403  (no value)  [TP_C-0.5mm]  (no BOM)
TP404  (no value)  [TP_C-0.5mm]  (no BOM)
TP405  (no value)  [TP_C-0.5mm]  (no BOM)
TP406  (no value)  [TP_C-0.5mm]  (no BOM)
TP407  (no value)  [TP_C-0.5mm]  (no BOM)
TP408  (no value)  [TP_C-0.5mm]  (no BOM)
TP409  (no value)  [TP_C-0.5mm]  (no BOM)
TP410  (no value)  [TP_C-0.5mm]  (no BOM)
U401  USBLC6-2SC6  [SOT23-6L-STM]

### Ports
USB (harness USB)

### Harnesses
USB: DP, DM, DISC

### Nets
+3V3: Q401.3(C) R401.2
+5V: FB401.2 TP402.1
+5V_VBUS: F401.1 J401.A4(VBUS) J401.A9(VBUS) J401.B4(VBUS) J401.B9(VBUS) TP403.1
+5V_VBUS_FUSE: C401.2 F401.2 FB401.1 U401.5(VBUS)
GND: C401.1 J401.A1(GND) J401.A12(GND) J401.B1(GND) J401.B12(GND) R403.1 R405.1 R406.1 TP401.1 U401.2(GND)
CON_CC1: J401.A5(CC1) R405.2 TP409.1  [project net CON_CC1_4]
CON_CC2: J401.B5(CC2) R406.2 TP410.1  [project net CON_CC2_4]
CON_USB_N: J401.A7(DN1) J401.B7(DN2) TP408.1 U401.3(I/O2)  [project net CON_USB_N_4]
CON_USB_P: J401.A6(DP1) J401.B6(DP2) TP407.1 U401.1(I/O1)  [project net CON_USB_P_4]
STM_BOOT1_USB_DISC: R402.2 ; port USB.DISC
STM_USB_N: TP406.1 U401.4(I/O2) ; port USB.DM
STM_USB_P: R404.2 TP405.1 U401.6(I/O1) ; port USB.DP
USB_DISC: Q401.1(B) R401.1 R402.1 R403.2 TP404.1  [project net USB_DISC_4]
NetQ401_2: Q401.2(E) R404.1

Not connected (* = marked no-connect by the designer): J401 A8(SBU1)* B8(SBU2)* SH1(SHIELD1)* SH2(SHIELD2)* SH3(SHIELD3)* SH4(SHIELD4)*

### Notes on the sheet
- R403 (10 KOhm) необходим для конфигурации вывода GPIOB2 (BOOT1) в режим нормальной загрузки, при запуске микроконтроллера.
- Title
- Size:
- Date:
- A3
- Number:
- Time:
- Revision:
- Sheet
- of
- File:
- (in symbol MF-NSMF150) PTC
- (in symbol TYPE-C-31-M-12) USB Type-C

### Library data of the parts
C401 = CAP-100N: as C501 on sheet Encoder; Mount: Surface Mount; Tolerance: 5 %; Type: Capacitor
F401 = MF-NSMF150: PTC Resettable Fuses 6V 1.5A; Type: Fuse; Mount: Surface Mount; PartNumber: MF-NSMF150
FB401 = BLM21PG221SN1D: 220Ω @ 100MHz 2A 45mΩ 0805 Ferrite Beads; Impedance: 220 Ohm; Mount: Surface Mount; Type: Ferrite Bead; DC Current: 2 A; PartNumber: BLM21PG221SN1D
J401 = TYPE-C-31-M-12: USB - Type C Female 16 8.94*7.3mm USB Connectors; Type: Connector; Mount: Surface Mount; PartNumber: TYPE-C-31-M-12
Q401 = BC817-40: NPN 500mA 45V 300mW SOT-23, hFE 250-600; Type: Transistor; Package: SOT23-3; Mount: Surface Mount; PartNumber: BC817-40
R401 = RES-47K: Chip Resistor, 47 KOhm, +/- 1%; Voltage Rating: 50 V; Mount: Surface Mount; Tolerance: 1 %; Type: Resistor
R402 = RES-1K: Chip Resistor, 1 KOhm, +/- 1%; Voltage Rating: 50 V; Mount: Surface Mount; Tolerance: 1 %; Type: Resistor
R403 = RES-10K: as R207 on sheet MCU; Mount: Surface Mount; Tolerance: 1 %; Type: Resistor
R404 = RES-1K5: Chip Resistor, 1.5 KOhm, +/- 1%; Voltage Rating: 50 V; Mount: Surface Mount; Tolerance: 1 %; Type: Resistor
R405 R406 = RES-5K1: Chip Resistor, 5.1 KOhm, +/- 1%; Voltage Rating: 50 V; Mount: Surface Mount; Tolerance: 1 %; Type: Resistor
TP401-TP410 = TestPad
U401 = USBLC6-2SC6: Very low capacitance ESD protection  3.5 pF max; ESD: 25 kV; Mount: Surface Mount; Type: TVS Diode; PartNumber: USBLC6-2SC6

## Nets that join several sheets
+3V3: MCU (13 pins), Encoder (R501.2 R502.2 R503.2), LDO (C302.1 C305.2 TP302.1 U301.5), Buttons (24 pins), USB (Q401.3 R401.2)
+5V: LDO (C301.1 C303.2 U301.1 U301.3), USB (FB401.2 TP402.1)
GND: MCU (13 pins), Encoder (7 pins), LDO (7 pins), Buttons (48 pins), USB (10 pins)
STM_BOOT1_USB_DISC: MCU (U201.20), USB (R402.2)
STM_KEY_1: MCU (U201.40), Buttons (R606.2)
STM_KEY_2: MCU (U201.39), Buttons (R607.2)
STM_KEY_3: MCU (U201.38), Buttons (R608.2)
STM_KEY_4: MCU (U201.43), Buttons (R609.2)
STM_KEY_5: MCU (U201.42), Buttons (R610.2)
STM_KEY_6: MCU (U201.41), Buttons (R611.2)
STM_KEY_7: MCU (U201.2), Buttons (R612.2)
STM_KEY_8: MCU (U201.46), Buttons (R613.2)
STM_KEY_9: MCU (U201.45), Buttons (R619.2)
STM_KEY_10: MCU (U201.10), Buttons (R620.2)
STM_KEY_11: MCU (U201.4), Buttons (R621.2)
STM_KEY_12: MCU (U201.3), Buttons (R622.2)
STM_KEY_13: MCU (U201.13), Buttons (R623.2)
STM_KEY_14: MCU (U201.12), Buttons (R624.2)
STM_KEY_15: MCU (U201.11), Buttons (R625.2)
STM_KEY_16: MCU (U201.14), Buttons (R626.2)
STM_KEY_17: MCU (U201.15), Buttons (R627.2)
STM_KEY_18: MCU (U201.16), Buttons (R628.2)
STM_KEY_19: MCU (U201.31), Buttons (R629.2)
STM_KEY_20: MCU (U201.30), Buttons (R630.2)
STM_KEY_21: MCU (U201.29), Buttons (R631.2)
STM_KEY_22: MCU (U201.28), Buttons (R637.2)
STM_KEY_23: MCU (U201.26), Buttons (R638.2)
STM_KEY_24: MCU (U201.22), Buttons (R639.2)
STM_KEY_25: MCU (U201.17), Encoder (R506.2)
STM_PHASE_A: MCU (U201.19), Encoder (R504.2)
STM_PHASE_B: MCU (U201.18), Encoder (R505.2)
STM_USB_N: MCU (U201.32), USB (TP406.1 U401.4)
STM_USB_P: MCU (U201.33), USB (R404.2 TP405.1 U401.6)